# EAGLE schematic controller (EAGLE 9.6.2)

## Sheet 1 of 2: Logic
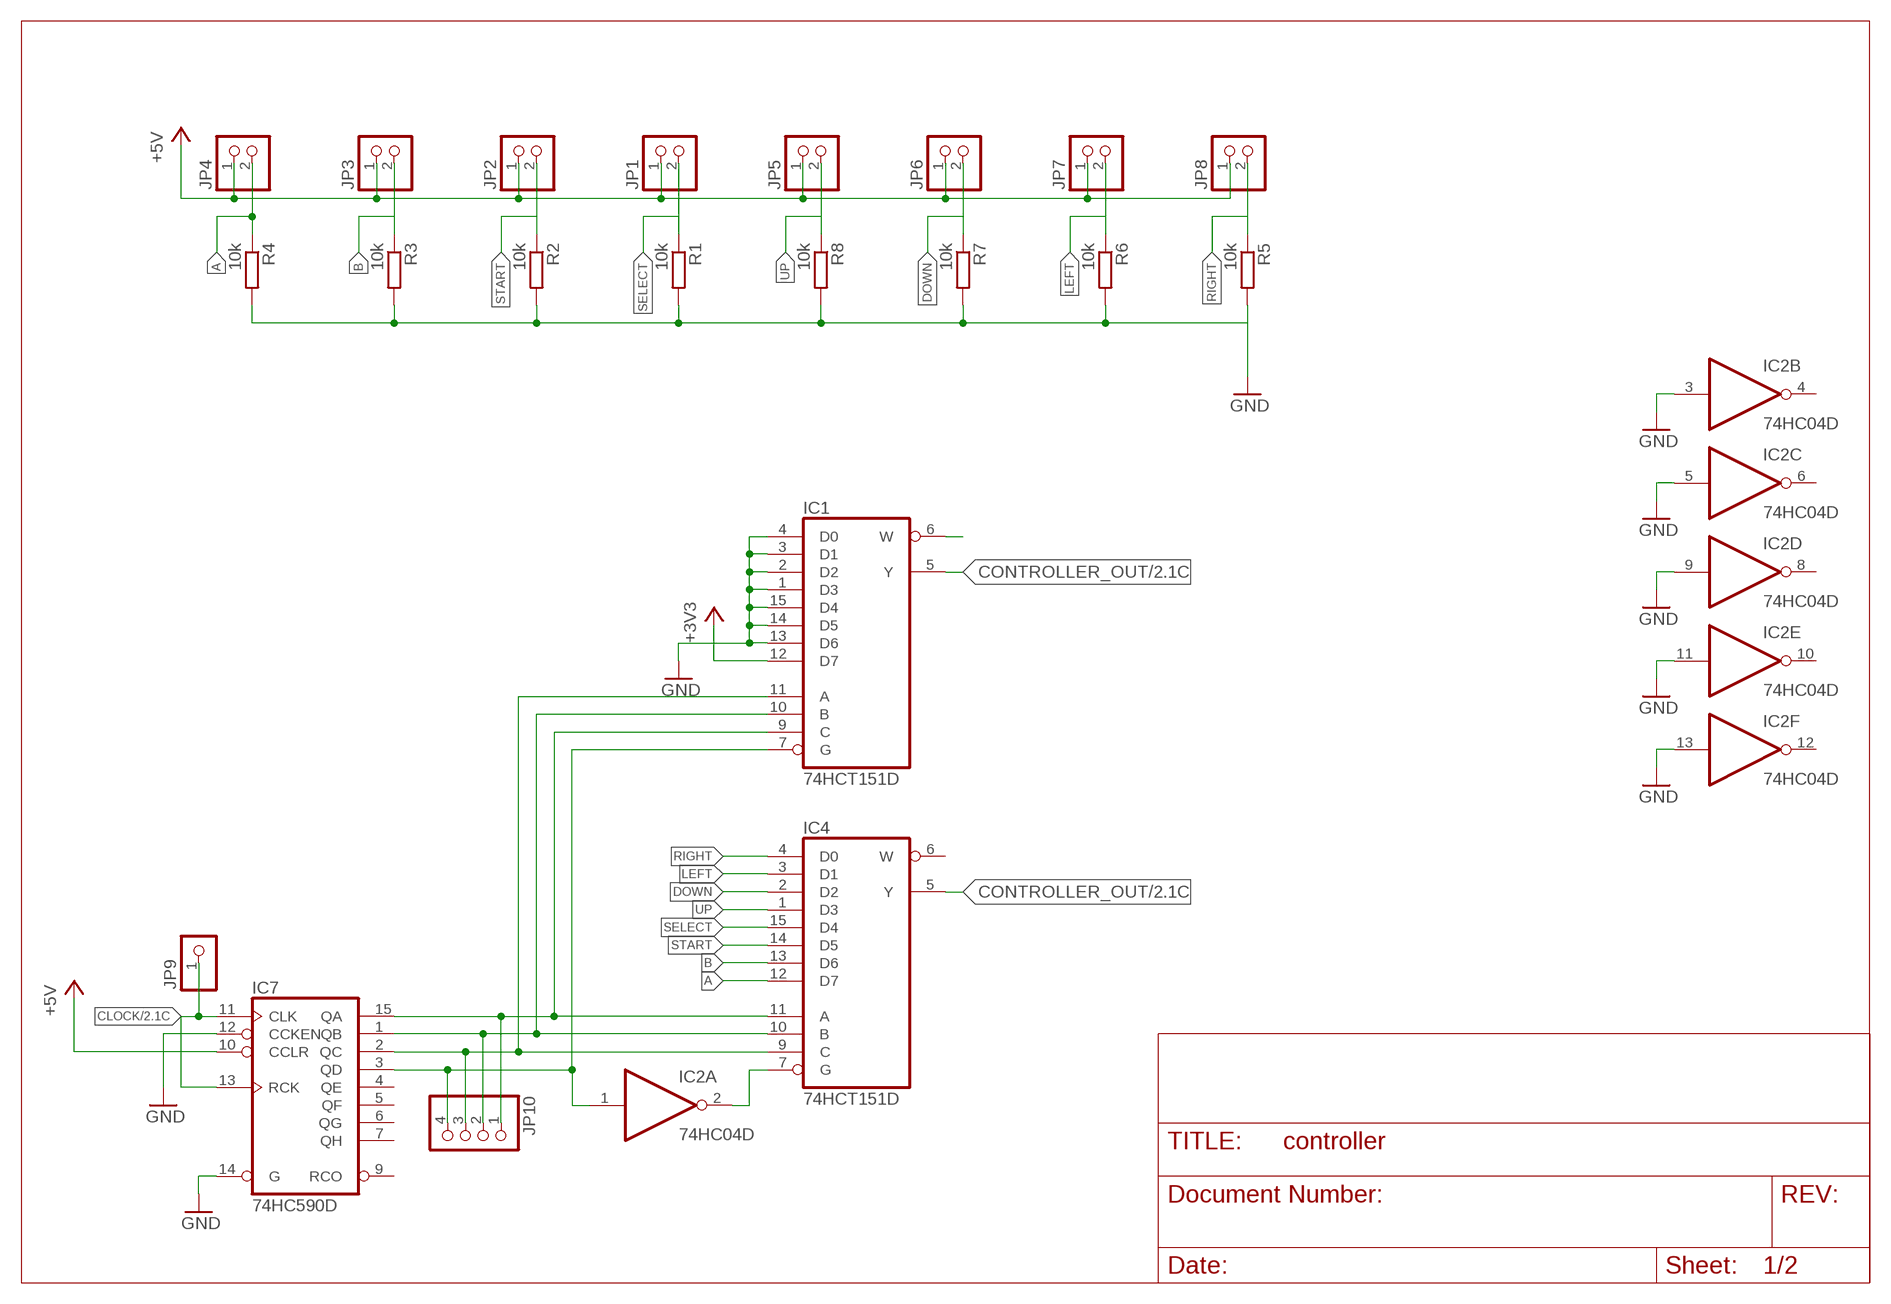
[diagram p0: schematic, sheet 1]

### Parts
IC1  74HCT151D  [SO16]
IC2  74HC04D  [SO14]
IC4  74HCT151D  [SO16]
IC7  74HC590D  [SO16]
JP1  PINHD-1X2  [1X02]
JP2  PINHD-1X2  [1X02]
JP3  PINHD-1X2  [1X02]
JP4  PINHD-1X2  [1X02]
JP5  PINHD-1X2  [1X02]
JP6  PINHD-1X2  [1X02]
JP7  PINHD-1X2  [1X02]
JP8  PINHD-1X2  [1X02]
JP9  PINHD-1X1  [1X01]
JP10  PINHD-1X4  [1X04]
R1  10k  R-EU_R0805  [R0805]
R2  10k  R-EU_R0805  [R0805]
R3  10k  R-EU_R0805  [R0805]
R4  10k  R-EU_R0805  [R0805]
R5  10k  R-EU_R0805  [R0805]
R6  10k  R-EU_R0805  [R0805]
R7  10k  R-EU_R0805  [R0805]
R8  10k  R-EU_R0805  [R0805]

### Nets
+3V3: IC1.12(D7)
+5V: IC7.10(CCLR) JP1.1 JP2.1 JP3.1 JP4.1 JP5.1 JP6.1 JP7.1 JP8.1 ; also sheet 2
A: IC4.12(D7) JP4.2 R4.1
B: IC4.13(D6)
CLOCK: IC7.11(CLK) IC7.13(RCK) JP9.1 ; also sheet 2
CONTROLLER_OUT: IC1.5(Y) IC4.5(Y) ; also sheet 2
DOWN: IC4.2(D2)
GND: IC1.1(D3) IC1.2(D2) IC1.3(D1) IC1.4(D0) IC1.13(D6) IC1.14(D5) IC1.15(D4) IC2.3(B:I) IC2.5(C:I) IC2.9(D:I) IC2.11(E:I) IC2.13(F:I) IC7.12(CCKEN) IC7.14(G) ; also sheet 2
LEFT: IC4.3(D1)
N$1: JP1.2 R1.1
N$2: JP2.2 R2.1
N$4: JP3.2 R3.1
N$5: IC1.9(C) IC4.11(A) IC7.15(QA) JP10.1
N$6: IC1.11(A) IC4.9(C) IC7.2(QC) JP10.3
N$7: JP8.2 R5.1
N$8: JP7.2 R6.1
N$9: JP6.2 R7.1
N$10: IC1.10(B) IC4.10(B) IC7.1(QB) JP10.2
N$11: R1.2 R2.2 R3.2 R4.2 R5.2 R6.2 R7.2 R8.2 ; supply symbol labelled GND
N$12: IC2.2(A:O) IC4.7(G)
N$13: IC1.6(W)
N$24: IC1.7(G) IC2.1(A:I) IC7.3(QD) JP10.4
RIGHT: IC4.4(D0)
SELECT: IC4.15(D4)
START: IC4.14(D5)
UP: IC4.1(D3) JP5.2 R8.1
Unconnected: IC2.4(B:O) IC2.6(C:O) IC2.8(D:O) IC2.10(E:O) IC2.12(F:O) IC4.6(W) IC7.4(QE) IC7.5(QF) IC7.6(QG) IC7.7(QH) IC7.9(RCO)

## Sheet 2 of 2: Power & I/O
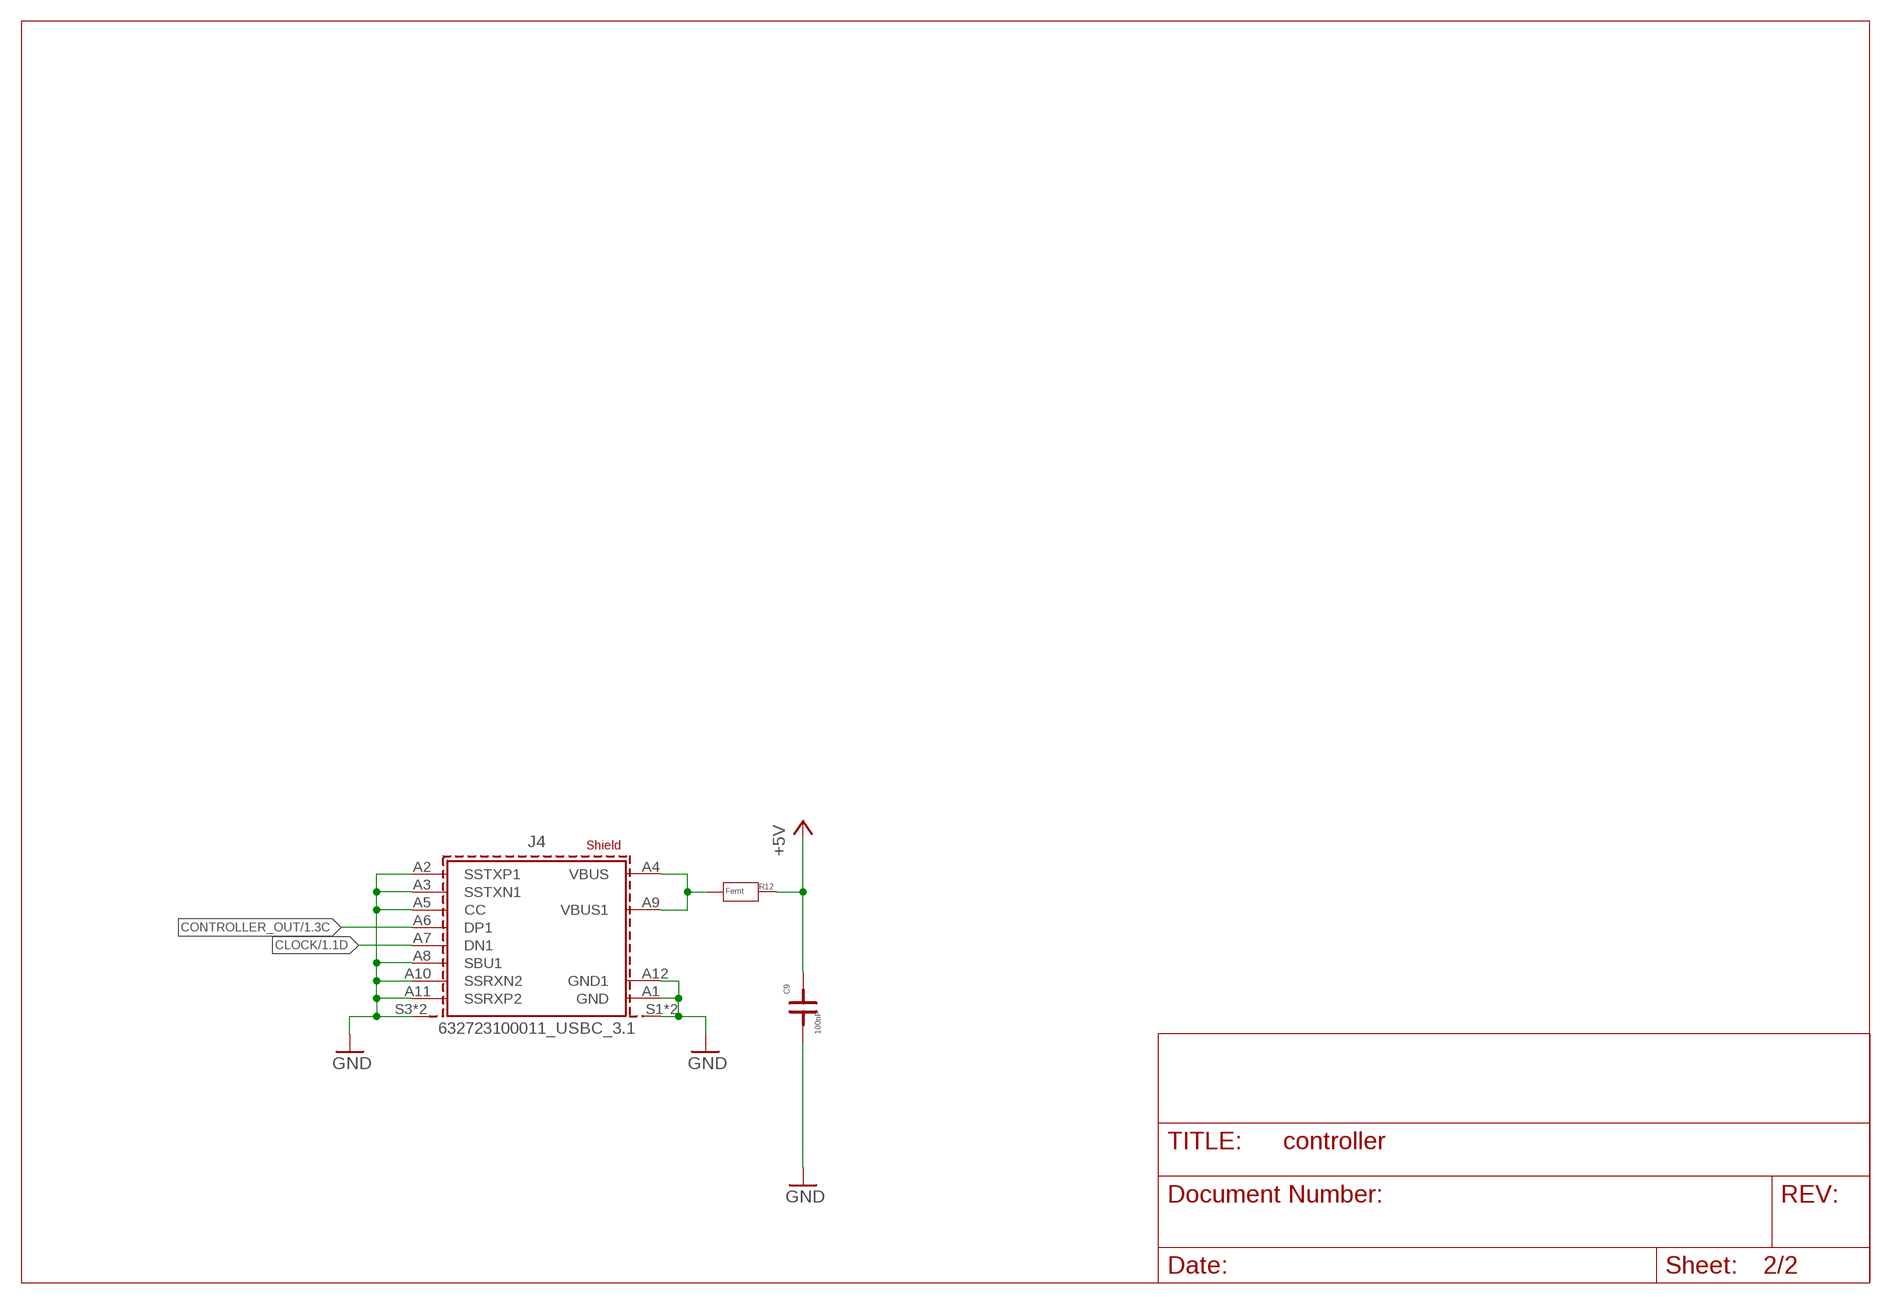
[diagram p1: schematic, sheet 2]

### Parts
C9  100nF  C1  [0805F]
J4  632723100011_USBC_3.1  [632723100011_USBC_3.1]
R12  Ferrit  R2  [1206]

### Nets
+5V: C9.2 R12.2 ; also sheet 1
CLOCK: J4.A7(DN1) ; also sheet 1
CONTROLLER_OUT: J4.A6(DP1) ; also sheet 1
GND: C9.1 J4.A1(GND) J4.A2(SSTXP1) J4.A3(SSTXN1) J4.A5(CC) J4.A8(SBU1) J4.A10(SSRXN2) J4.A11(SSRXP2) J4.A12(GND1) J4.S1(SHIELD1) J4.S2(SHIELD1) J4.S3(SHIELD) J4.S4(SHIELD) ; also sheet 1
N$3: J4.A4(VBUS) J4.A9(VBUS1) R12.1

## Power pins joined to a net without a drawn wire
GND: IC1.8(GND) IC2.7(P:GND) IC4.8(GND) IC7.8(GND)
VCC: IC1.16(VCC) IC2.14(P:VCC) IC4.16(VCC) IC7.16(VCC)

## Library data of the parts
C9 = deto:C
IC1 IC4 = 74xx-eu:74*151: Data SELECTOR/MULTIPLEXER
IC2 = 74xx-eu:74*04: Hex INVERTER
IC7 = 74xx-eu:74*590: 8-bit binary COUNTER, output register
J4 = Eagle_WR-USB (rev22c):632723100011_USBC_3.1: WR-COM USB 3.1 Type C Receptacle Horizontal THT/SMT Kind Properties Durability:10 000 Mating cycles Connector Type:USB 3.1 Type C Gender:Receptacle Type:Horizontal General Information Operating Temperature:-40up to +105 °C Compliance:RoHS Electrical Properties Working Voltage:20V (DC) Withstanding Voltage:100V (AC) Contact Resistance:30 mΩ Material Properties Insulator Material:LCP Insulator Flammability Rating:UL94 V-0 Color:Black Contact Material:Brass Contact Plating:2µ” Gold over 30µ” Pd-Ni Contact Type:Stamped Shielding Material:Steel Shielding Plating:Matte Tin <https://www.we-online.com/catalog/media/o144501v209%20Family_WR-COM_632723x00011.jpg> Details see: https://www.we-online.com/catalog/en/COM_3_1_THR_SMT_TYPE_C_RECEPTACLE_HORIZONTAL/ Updated by Ella Wu 2021-09-28 2021 (C) Würth Elektronik
JP1-JP8 = pinhead:PINHD-1X2: PIN HEADER
JP9 = pinhead:PINHD-1X1: PIN HEADER
JP10 = pinhead:PINHD-1X4: PIN HEADER
R1-R8 = rcl:R-EU_: RESISTOR, European symbol; SPICEPREFIX: R
R12 = deto:R: Widerstand 400 mil - 0805 - 1206